# EAGLE design SOCL 506 GINDRING (EAGLE 9.6.2)
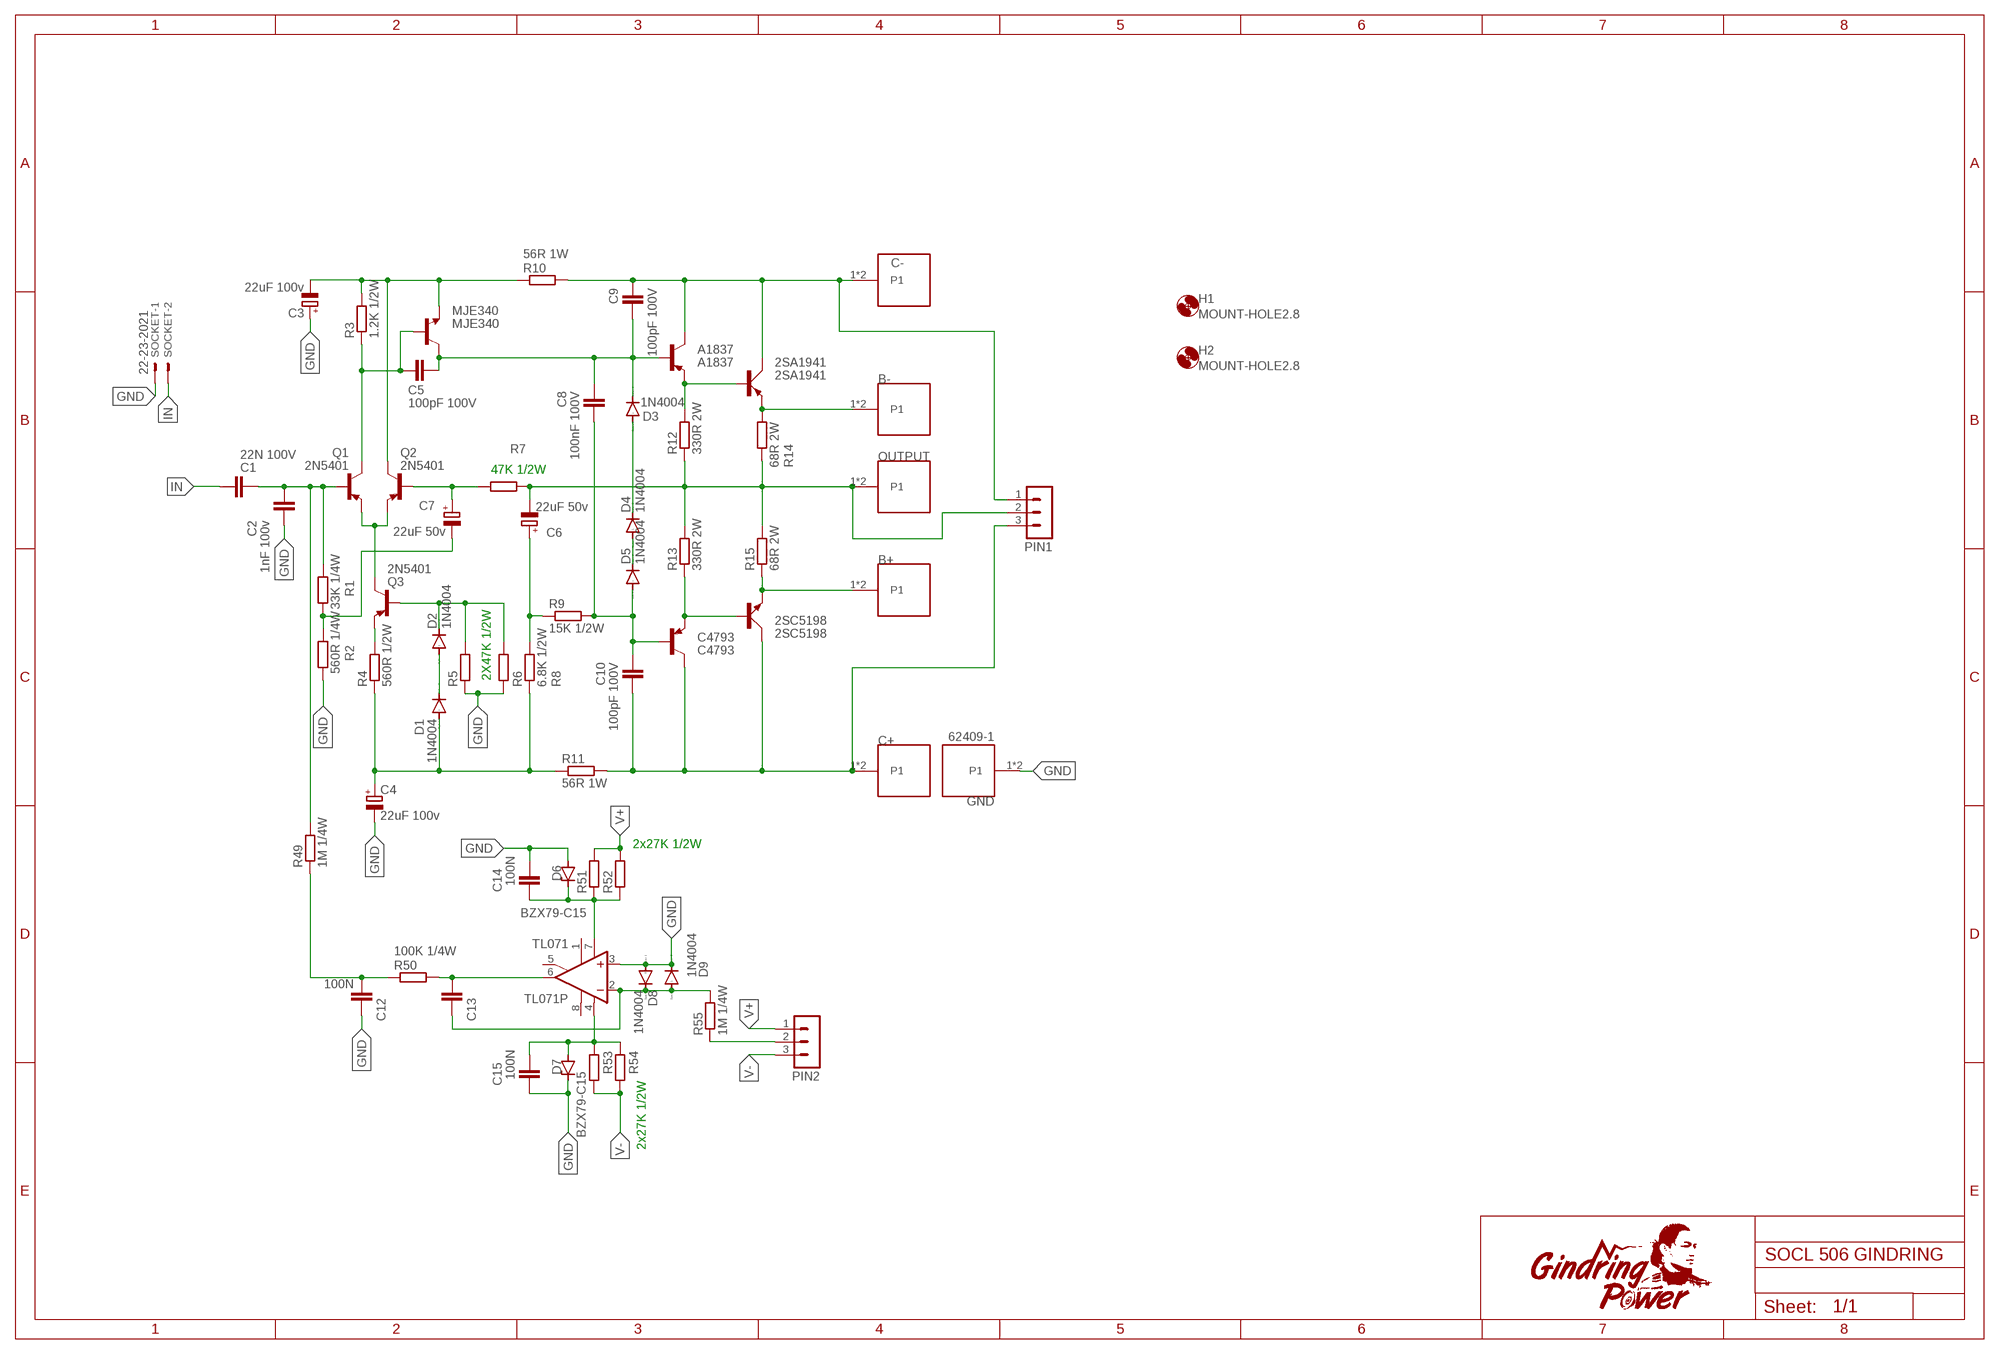
[diagram p0: schematic, sheet 1]

## Parts
2SA1941  2SA1941  TIP2955  [TOP3AV]
2SC5198  2SC5198  TIP3055  [TOP3AV]
A1837  A1837  2SA1837  [TO220V]
B+  62409-1  [TE_62409-1]
B-  62409-1  [TE_62409-1]
C1  22N 100V  C5/2.5  [C5B2.5]
C2  1nF 100v  C5/2.5  [C5B2.5]
C3  22uF 100v  CPOL-EUE3.5-8  [E3,5-8]
C4  22uF 100v  CPOL-EUE3.5-8  [E3,5-8]
C5  100pF 100V  C5/2.5  [C5B2.5]
C6  22uF 50v  CPOL-EUE2,5-6E  [E2,5-6E]
C7  22uF 50v  CPOL-EUE2,5-6E  [E2,5-6E]
C8  100nF 100V  C5/2.5  [C5B2.5]
C9  100pF 100V  C5/2.5  [C5B2.5]
C10  100pF 100V  C5/2.5  [C5B2.5]
C12  100N  C5/2.5  [C5B2.5]
C13  100N  C5/2.5  [C5B2.5]
C14  100N  C5/2.5  [C5B2.5]
C15  100N  C5/2.5  [C5B2.5]
C4793  C4793  2SA1837  [TO220V]
C+  62409-1  [TE_62409-1]
C-  62409-1  [TE_62409-1]
D1  1N4004  [DO41-10]
D2  1N4004  [DO41-10]
D3  1N4004  [DO41-10]
D4  1N4004  [DO41-10]
D5  1N4004  [DO41-10]
D6  BZX79-C15  1N4728  [DO41Z10]
D7  BZX79-C15  1N4728  [DO41Z10]
D8  1N4004  [DO41-10]
D9  1N4004  [DO41-10]
GND  62409-1  [TE_62409-1]
H1  MOUNT-HOLE2.8  [2,8]
H2  MOUNT-HOLE2.8  [2,8]
MJE340  MJE340  [TO126]
OUTPUT  62409-1  [TE_62409-1]
PIN1  MA03-1  [MA03-1]
PIN2  MA03-1  [MA03-1]
Q1  2N5401  MPSA56-TO92  [TO92-CBE]
Q2  2N5401  MPSA56-TO92  [TO92-CBE]
Q3  2N5401  MPSA56-TO92  [TO92-CBE]
R1  33K 1/4W  R-EU_0207/10  [0207/10]
R2  560R 1/4W  R-EU_0207/10  [0207/10]
R3  1.2K 1/2W  R-EU_0207/15  [0207/15]
R4  560R 1/2W  R-EU_0207/15  [0207/15]
R5  R-EU_0207/15  [0207/15]
R6  R-EU_0207/15  [0207/15]
R7  R-EU_0207/15  [0207/15]
R8  6.8K 1/2W  R-EU_0207/15  [0207/15]
R9  15K 1/2W  R-EU_0207/15  [0207/15]
R10  56R 1W  R-EU_0207/15  [0207/15]
R11  56R 1W  R-EU_0207/15  [0207/15]
R12  330R 2W  R-EU_0207/15  [0207/15]
R13  330R 2W  R-EU_0207/15  [0207/15]
R14  68R 2W  R-EU_0207/15  [0207/15]
R15  68R 2W  R-EU_0207/15  [0207/15]
R49  1M 1/4W  R-EU_0207/10  [0207/10]
R50  100K 1/4W  R-EU_0207/10  [0207/10]
R51  R-EU_0207/15  [0207/15]
R52  R-EU_0207/15  [0207/15]
R53  R-EU_0207/15  [0207/15]
R54  R-EU_0207/15  [0207/15]
R55  1M 1/4W  R-EU_0207/10  [0207/10]
SOCKET  22-23-2021  [22-23-2021]
TL071  TL071P  [DIL08]

## Nets
GND: C2.2 C3.+ C4.- C12.1 C14.2 C15.1 D6.A D7.C D8.A D9.C GND.1 GND.2(P1) R2.1 R5.1 R6.1 SOCKET.1 TL071.3(+IN)
IN: C1.1 SOCKET.2
N$1: C1.2 C2.1 Q1.B R1.2 R49.2
N$2: Q1.E Q2.E Q3.C
N$3: C5.1 MJE340.3(B) Q1.C R3.1
N$4: C7.- R1.1 R2.2
N$5: C3.- MJE340.1(E) Q2.C R3.2 R10.1
N$6: Q3.E R4.2
N$7: D2.C Q3.B R5.2 R6.2
N$8: D1.C D2.A
N$9: C4.+ D1.A R4.1 R8.1 R11.1
N$10: C7.+ Q2.B R7.1
N$11: 2SC5198.B C4793.3(E) R13.1
N$12: C6.- OUTPUT.1 OUTPUT.2(P1) PIN1.2 R7.2 R12.1 R13.2 R14.1 R15.2
N$13: C6.+ R8.2 R9.1
N$14: C8.1 C10.2 C4793.1(B) D5.A R9.2
N$15: 2SA1941.C A1837.2(C) C9.2 C-.1 C-.2(P1) PIN1.1 R10.2
N$16: A1837.1(B) C5.2 C8.2 C9.1 D3.C MJE340.2(C)
N$17: D3.A D4.C
N$18: D4.A D5.C
N$19: 2SC5198.C C10.1 C4793.2(C) C+.1 C+.2(P1) PIN1.3 R11.2
N$20: 2SA1941.B A1837.3(E) R12.2
N$21: 2SA1941.E B-.1 B-.2(P1) R14.2
N$22: C12.2 R49.1 R50.1
N$23: 2SC5198.E B+.1 B+.2(P1) R15.1
N$25: C14.1 D6.C R51.1 R52.1 TL071.7(V+)
N$26: C13.1 D8.C D9.A R55.2 TL071.2(-IN)
N$27: C15.2 D7.A R53.2 R54.2 TL071.4(V-)
N$28: C13.2 R50.2 TL071.6(OUT)
N$30: PIN2.2 R55.1
V+: PIN2.1 R51.2 R52.2
V-: PIN2.3 R53.1 R54.1
Unconnected: TL071.1(ON1) TL071.5(ON2) TL071.8(OPT)

## Notes on the sheet
- 47K 1/2W
- 2X47K 1/2W
- 2x27K 1/2W
- 2x27K 1/2W

## Library data of the parts
2SA1941 = transistor-power:TIP2955: PNP TRANSISTOR
2SC5198 = transistor-power:TIP3055: NPN TRANSISTOR
A1837 C4793 = 2SA1837:2SA1837: Check availability <https://pricing.snapeda.com/parts/2SA1837/Toshiba%20Semiconductor/view-part?ref=eda>; AVAILABILITY: In Stock; DESCRIPTION: Bipolar (BJT) Transistor PNP 230 V 1 A 70MHz 2 W Through Hole TO-220NIS; MF: Toshiba Semiconductor; MP: 2SA1837; PACKAGE: TO-220 Toshiba Semiconductor; PRICE: None
B+ B- C+ C- GND OUTPUT = 62409-1:62409-1: CONN QC TAB 0.250 SOLDER Check availability <https://pricing.snapeda.com/parts/62409-1/TE%20Connectivity/view-part?ref=eda>; AVAILABILITY: In Stock; COMMENT: 62409-1; DESCRIPTION: Faston 20-16 AWG Straight Non-Insulated Printed Circuit Board Tab Terminal; MF: TE Connectivity; MP: 62409-1; PACKAGE: None; PRICE: None; PURCHASE-URL: https://pricing.snapeda.com/search?q=62409-1&ref=eda
C1 C2 C5 C8-C10 C12-C15 = capacitor-wima:C: CAPACITOR naming: grid - package width
C3 C4 C6 C7 = rcl:CPOL-EU: POLARIZED CAPACITOR, European symbol; SPICEPREFIX: C
D1-D5 D8 D9 = diode:1N4004: DIODE general purpose rectifier, 1 A
D6 D7 = diode:1N4728: Z DIODE 3.3 V, 1W, 5 percent
H1 H2 = holes:MOUNT-HOLE: MOUNTING HOLE with drill center marker
MJE340 = MJE340:MJE340: NPN TRANSISTOR Check availability <https://pricing.snapeda.com/parts/MJE340/STMicroelectronics/view-part?ref=eda>; AVAILABILITY: In Stock; DESCRIPTION: Bipolar (BJT) Transistor NPN 300 V 500 mA - 20.8 W Through Hole SOT-32-3; MF: STMicroelectronics; MP: MJE340; PACKAGE: TO-126-3 Motorola; PRICE: None; PURCHASE-URL: https://pricing.snapeda.com/search?q=MJE340&ref=eda
PIN1 PIN2 = con-lstb:MA03-1: PIN HEADER; OC_FARNELL: unknown; OC_NEWARK: unknown
Q1-Q3 = transistor-pnp:*-?: PNP Transistor
R1 R2 R49 R50 R55 = resistor 2:R-EU_: RESISTOR, European symbol; SPICEPREFIX: R
R3-R15 R51-R54 = resistor coba:R-EU_: RESISTOR, European symbol; SPICEPREFIX: R
SOCKET = con-molex:22-23-2021: .100" (2.54mm) Center Header - 2 Pin; MF: MOLEX; MPN: 22-23-2021; OC_FARNELL: 1462926; OC_NEWARK: 25C3832
TL071 = TL071:TL071: OP AMP Check availability <https://pricing.snapeda.com/parts/TL071/STMicroelectronics/view-part?ref=eda>; AVAILABILITY: Not in stock; CHECK_PRICES: https://www.snapeda.com/parts/TL071/STMicroelectronics/view-part/?ref=eda; DESCRIPTION: Op Amp Single Low Noise Amplifier ±18V 8-Pin SO N T/R; MF: STMicroelectronics; MP: TL071; PACKAGE: None; PRICE: None; SNAPEDA_LINK: https://www.snapeda.com/parts/TL071/STMicroelectronics/view-part/?ref=snap

## Board
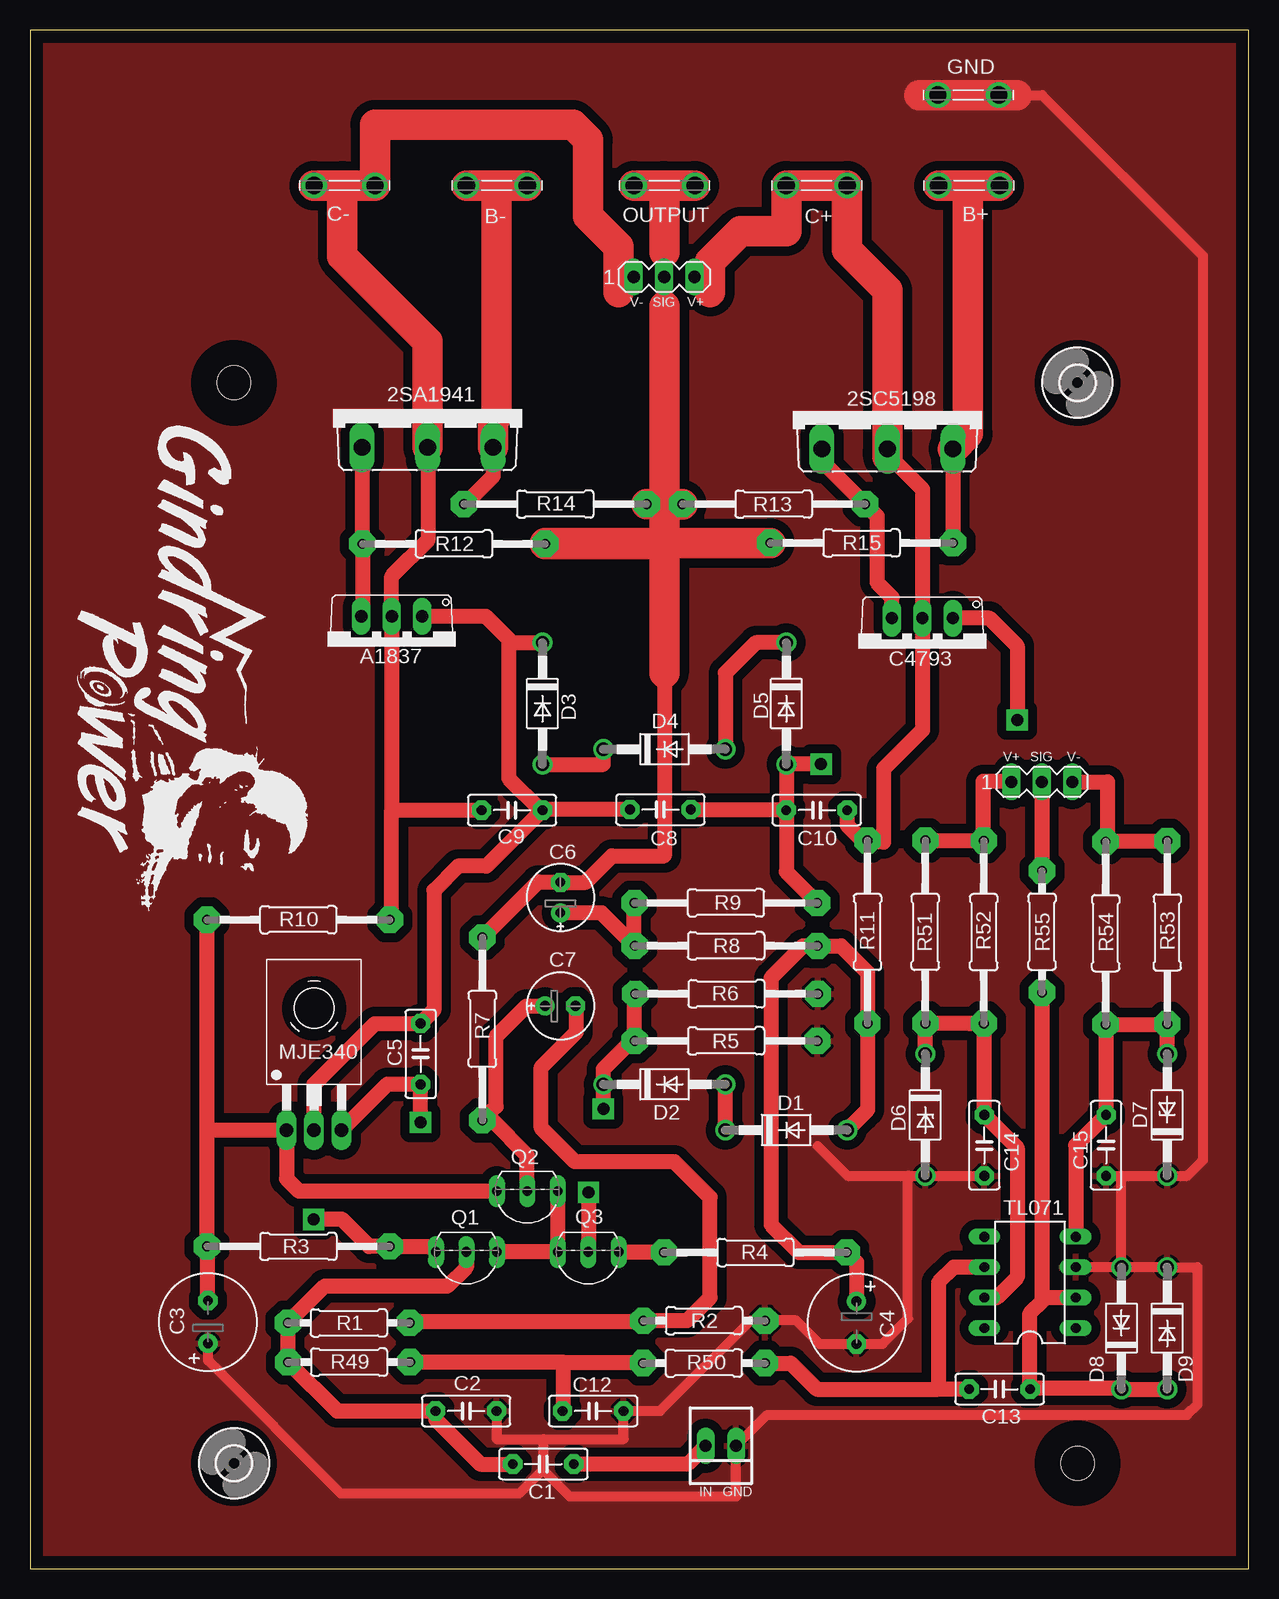
[diagram p1: board, top side]
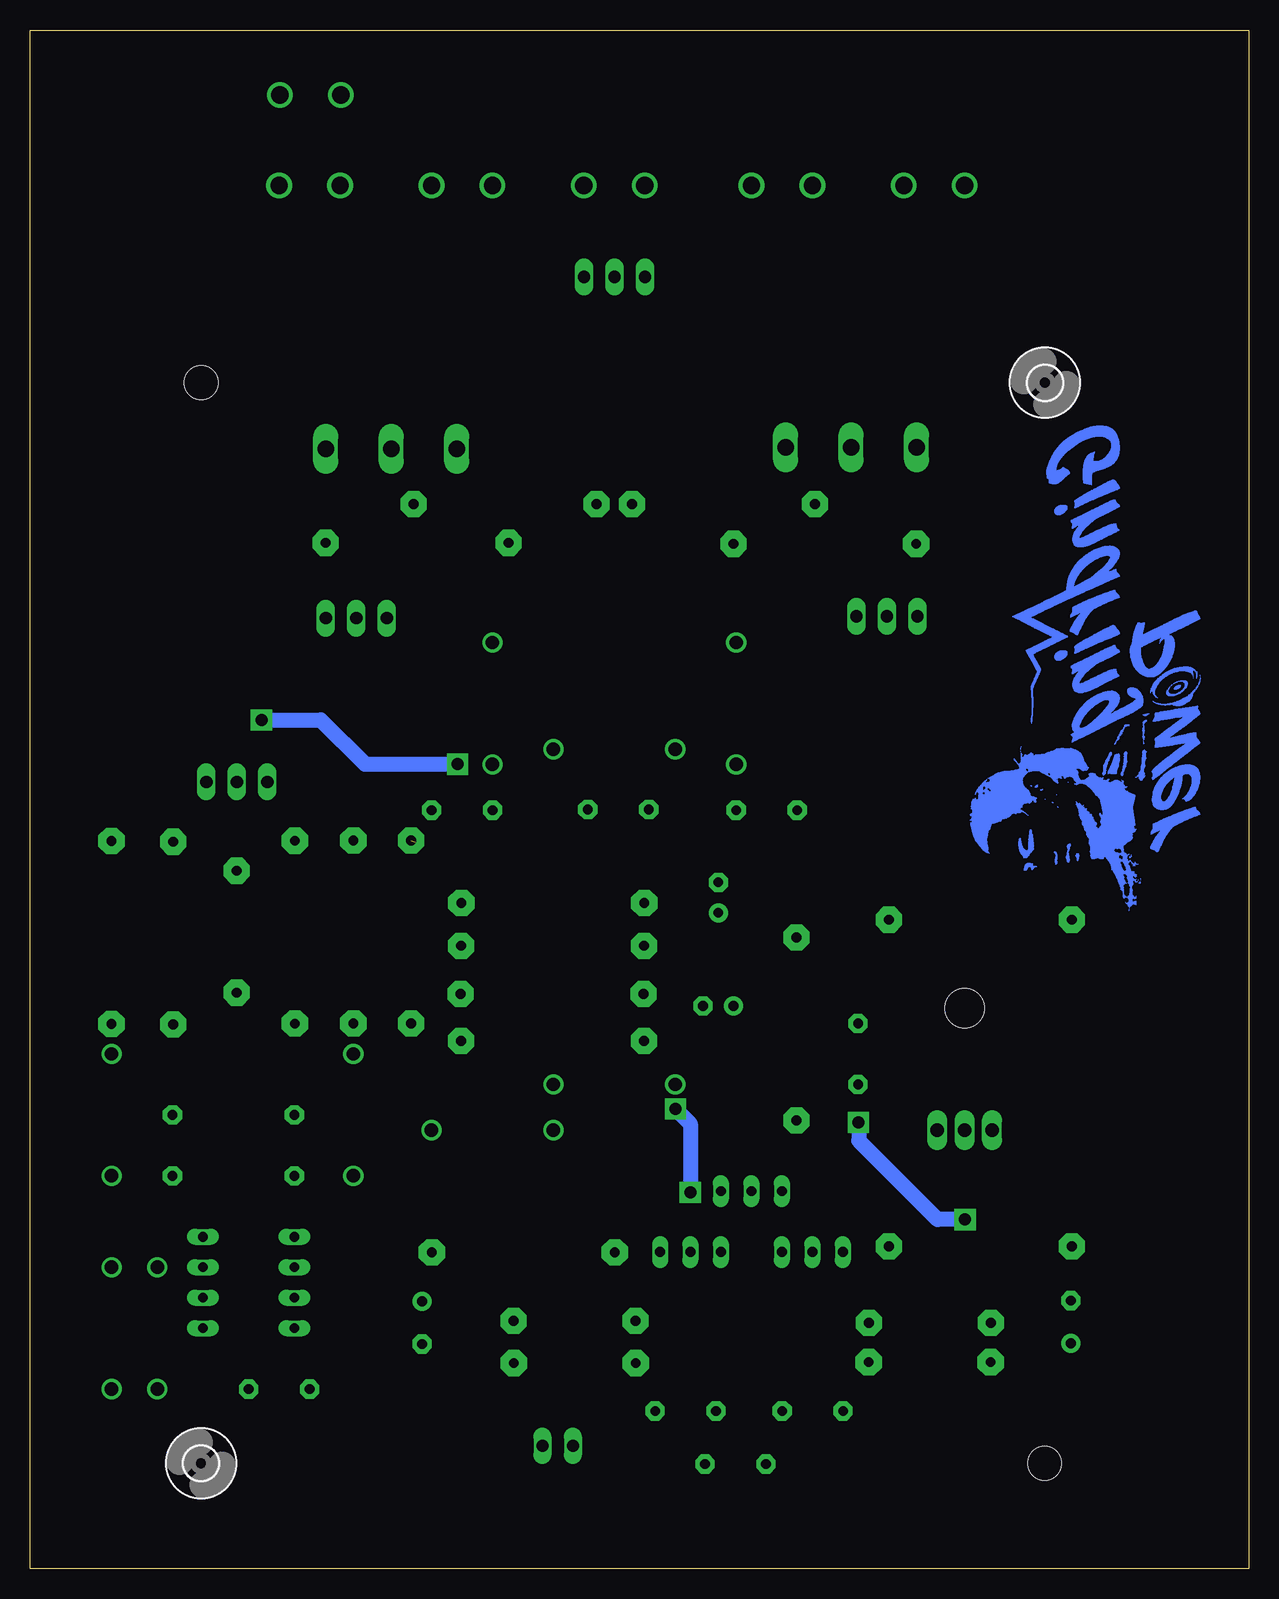
[diagram p2: board, bottom side, seen from below]

Size 101.6 x 128.27 mm. Coordinates in mm from the lower left corner, seen from the top.
Outline: 0,128.27 0,0 101.6,0 101.6,128.27 0,128.27
Copper layers (1*16): Top 0.035mm / dielectric 1.5mm / Bottom 0.035mm
Design rules "default *": minimum track width 6mil, minimum drill 0.35mm, track to track 30mil, track to pad 30mil, pad to pad 30mil, via to via 30mil, smd to smd 30mil, copper to edge 40mil, drill to drill 6mil, minimum pad ring 10mil, minimum via ring 8mil, stop-mask expansion 4mil, vias tented up to drill 0mil, thermal gap 10mil

### Footprints (pad centres in the part's own frame; a part is rotated, then mirrored left to right if it is on the bottom)
TOP3AV = drill 1.397 long: B -5.461,-3.175; C 0,-3.175; E 5.461,-3.175
TO220V = drill 1.016 long: 1 -2.54,-2.54; 2 0,-2.54; 3 2.54,-2.54
TE_62409-1 = drill 1.43: 1 -2.54,0; 2 2.54,0
C5B2.5 = drill 0.813 pad 1.6 octagon: 1 -2.54,0; 2 2.54,0
E3,5-8 = drill 0.813 pad 1.6: + -1.778,0 | drill 0.813 pad 1.6 octagon: - 1.778,0
E2,5-6E = drill 0.813 pad 1.575: + -1.27,0 | drill 0.813 pad 1.575 octagon: - 1.27,0
DO41-10 = drill 1.118: A 5.08,0; C -5.08,0
DO41Z10 = drill 1.118: A 5.08,0; C -5.08,0
2,8 = hole 2.8: 0,0
TO126 = drill 1.118 long: 1 -2.286,-5.08; 2 0,-5.08; 3 2.286,-5.08 | hole 3.302: 0,5.08
MA03-1 = drill 1.016 long: 1 -2.54,0; 2 0,0; 3 2.54,0
TO92-CBE = drill 0.813 long: B 0,0; C 2.54,0; E -2.54,0
0207/10 = drill 0.813 pad 2.184 octagon: 1 -5.08,0; 2 5.08,0
0207/15 = drill 0.813 pad 2.184 octagon: 1 -7.62,0; 2 7.62,0
22-23-2021 = drill 1 long: 1 -1.27,0; 2 1.27,0
DIL08 = drill 0.813 pad 1.27 long: 1 -3.81,-3.81; 2 -1.27,-3.81; 3 1.27,-3.81; 4 3.81,-3.81; 5 3.81,3.81; 6 1.27,3.81; 7 -1.27,3.81; 8 -3.81,3.81

### Placement (x,y rotation side)
2SA1941  33.15,96.66 0 top
2SC5198  71.48,96.52 0 top
A1837  30.16,76.86 180 top
B+  78.29,115.31 0 top
B-  38.92,115.31 180 top
C1  42.79,8.73 180 top
C2  36.36,13.15 0 top
C3  14.83,20.57 90 top
C4  68.91,20.51 270 top
C5  32.57,42.92 90 top
C6  44.22,55.95 90 top
C7  44.22,46.91 0 top
C8  52.55,63.28 180 top
C9  40.19,63.24 180 top
C10  65.59,63.24 180 top
C12  46.94,13.15 180 top
C13  80.83,14.98 180 top
C14  79.56,35.3 270 top
C15  89.72,35.3 90 top
C4793  74.4,76.7 180 top
C+  65.59,115.31 180 top
C-  26.22,115.31 180 top
D1  63.05,36.57 0 top
D2  52.89,40.38 0 top
D3  42.73,72.13 270 top
D4  52.89,68.32 0 top
D5  63.05,72.13 270 top
D6  74.64,37.84 270 top
D7  94.8,37.84 90 top
D8  90.99,20.06 90 top
D9  94.8,20.06 270 top
GND  78.22,122.85 0 top
H1  17.01,8.79 90 top
H2  87.34,8.79 90 bottom
H5  MOUNT-HOLE2.8  [2,8]  16.99,98.87 270 bottom
H6  MOUNT-HOLE2.8  [2,8]  87.32,98.87 270 top
MJE340  23.68,41.65 0 top
OUTPUT  52.89,115.31 0 top
PIN1  52.87,107.69 0 top
PIN2  84.35,65.59 0 top
Q1  36.38,26.41 180 top
Q2  41.46,31.49 180 top
Q3  46.54,26.41 180 top
R1  26.58,20.49 180 top
R2  56.21,20.68 180 top
R3  22.37,26.87 180 top
R4  60.47,26.37 180 top
R5  58.03,44 180 top
R6  58.07,47.92 180 top
R7  37.71,45 90 top
R8  58.03,51.93 180 top
R9  58.01,55.5 0 top
R10  22.37,54.1 0 top
R11  69.82,53.09 90 top
R12  35.34,85.44 180 top
R13  62,88.75 180 top
R14  43.79,88.75 180 top
R15  69.33,85.52 180 top
R49  26.6,17.22 180 top
R50  56.18,17.14 0 top
R51  74.64,53.09 90 top
R52  79.51,53.07 90 top
R53  94.81,53.05 270 top
R54  89.67,52.98 270 top
R55  84.37,53.11 270 top
SOCKET  57.6,10.25 180 top
TL071  83.37,23.87 90 top

### Tracks (layer width: path | path; a pad name or v marks a point on that pad's centre or on a via)
GND
  Top 0.813: C2.2 38.9,10.81 42.83,10.81 | 42.83,10.81 49.48,10.81 C12.1 52.54,13.15 60.07,20.68 R2.1 61.31,20.7 63.86,20.7 65.82,18.73 C4.- 71.08,18.73 73.21,20.86 73.21,32.76 | 73.21,32.76 D6.A | 74.7,32.76 C14.2 | 94.83,25.14 97.34,25.14 97.34,13.71 96.45,12.82 61.44,12.82 SOCKET.1 58.87,6.04 44.99,6.04 42.77,8.26 | D9.C D8.A 90.99,32.76 | 90.97,25.14 TL071.3 | C15.1 90.99,32.76 | 90.99,32.76 D7.C | 42.77,8.26 40.77,6.26 25.93,6.26 14.83,17.36 C3.+ | 42.77,8.26 42.83,8.32 42.83,10.81 | 73.21,32.76 68.13,32.76 65.65,35.23 | 82.29,122.85 84.37,122.85 97.8,109.42 97.8,34.08 96.48,32.76 94.87,32.76
  Top 1.27: D6.A 74.7,32.76 | D7.C 94.87,32.76 | D9.C 94.83,25.14 | D8.A 90.97,25.14
  Top 2.54: 82.29,122.85 GND.2 GND.1 74.16,122.85
  pour Top: 0,128.27 0,0 101.6,0 101.6,128.27
IN
  Top 1.27: SOCKET.2 54.81,8.73 C1.1
N$1
  Top 1.27: Q1.B 36.38,25.14 34.81,23.57 24.57,23.57 R1.2 21.5,17.24 R49.2 25.59,13.15 C2.1 33.82,12.46 37.55,8.73 C1.2
N$2
  Top 1.27: Q2.E Q3.C Q1.E
N$3  (via drill 1 pad 1.78)
  Top 1.27: MJE340.3 29.77,40.38 C5.1 32.54,40.35 v32.54,37.21 | v23.65,29.11 23.67,29.13 26.01,29.13 28.27,26.87 R3.1 33.37,26.87 Q1.C
  Bottom 0.61: v23.65,29.11 23.62,29.13
  Bottom 1.27: v32.54,37.21 32.52,37.21 32.5,37.23 32.5,35.67 25.94,29.11 v23.65,29.11
N$4
  Top 1.27: 31.86,20.7 R1.1 31.76,20.59 51,20.59 51.08,20.68 R2.2 54.78,20.68 56.7,22.6 56.7,30.97 53.74,33.92 45.44,33.92 42.61,36.75 42.61,41.8 45.52,44.71 45.52,46.87 C7.-
N$5
  Top 1.27: Q2.C 22.41,31.49 21.39,32.5 MJE340.1 14.79,36.57 | 14.79,36.57 14.79,54.07 R10.1 | 14.79,36.57 14.79,26.91 R3.2 14.75,22.43 C3.-
N$6
  Top 1.27: R4.2 49.12,26.36 Q3.E
N$7  (via drill 1 pad 1.78)
  Top 1.27: v46.56,31.38 46.56,26.43 Q3.B | v47.79,38.33 47.79,40.36 D2.C 47.81,41.65 50.16,44 R5.2 50.41,47.88 R6.2
  Bottom 1.27: v46.56,31.38 46.56,37.1 v47.79,38.33
N$8
  Top 1.27: D1.C D2.A
N$9
  Top 1.27: 69.4,37.84 D1.A 69.82,38.26 R11.1 69.82,49.71 67.61,51.93 R8.1 64.44,51.93 61.78,49.27 61.78,28.68 64.09,26.36 R4.1 | R4.1 68.13,26.33 | R4.1 68.91,25.55 C4.+
N$10
  Top 1.27: R7.1 37.76,37.42 | Q2.B 41.46,34.47 38.55,37.38 R7.1 | R7.1 38.87,38.54 38.87,44.39 41.39,46.91 C7.+
N$11
  Top 1.27: C4793.3 71.86,80.97 70.61,82.22 70.61,87.76 R13.1 66.02,92.34 2SC5198.B 66.02,91.92
N$12
  Top 1.27: 52.89,74.67 52.89,59.43 48.52,59.43 46.31,57.22 C6.- 44.18,57.26 42.36,57.26 R7.2 | 52.89,109.76 52.89,109.75 52.87,109.73 PIN1.2 52.87,105.27 52.89,105.25
  Top 2.54: 52.85,115.31 OUTPUT.2 | 52.89,85.44 52.89,74.67 | 52.89,109.75 52.89,115.27 52.85,115.31 | OUTPUT.1 52.85,115.31 | 52.89,105.25 52.89,88.72 | R12.1 52.89,85.44 | R12.1 52.58,85.44 52.89,85.74 | 52.89,85.74 52.89,88.72 | 52.89,85.44 52.89,85.74 | 52.89,88.72 52.86,88.75 R14.1 R13.2 54.38,88.72 52.89,88.72 | R12.1 42.96,85.52 R15.2
N$13
  Top 1.27: R9.1 50.35,55.46 50.35,51.99 R8.2 47.66,54.68 C6.+
N$14  (via drill 1 pad 1.78)
  Top 1.27: C10.2 D5.A 63.07,67.07 v65.95,67.07 | v82.3,70.75 82.3,76.92 79.98,79.24 C4793.1 | R9.2 63.05,58.09 C10.2 | C10.2 55.14,63.24 C8.1
  Bottom 1.27: v82.3,70.75 77.37,70.75 73.68,67.07 v65.95,67.07
N$15
  Top 1.27: PIN1.1 49.08,107.69 | 2SA1941.C 33.17,93.47 33.17,85.74 30.16,82.73 A1837.2 30.16,63.24 | 30.16,63.24 C9.2 | 30.16,63.24 30.16,54.63 29.99,54.46 R10.2
  Top 2.54: 49.08,106.42 49.08,107.69 49.08,110.23 46.54,112.77 46.54,119.12 45.27,120.39 28.76,120.39 C-.1 26.03,115.31 | 23.66,115.29 C-.2 26.03,115.31 | 2SA1941.C 33.15,102.31 26.03,109.42 26.03,115.31
N$16
  Top 1.27: 39.9,77.49 37.99,79.4 A1837.1 | 39.9,77.49 40.19,77.21 D3.C | MJE340.2 23.68,40.38 28.76,45.46 C5.2 33.69,46.57 33.69,56.56 35.69,58.56 38.05,58.56 C9.1 42.54,63.24 | 39.9,77.49 39.9,65.88 42.54,63.24 | C8.2 42.59,63.28 42.54,63.24
N$17
  Top 1.27: D3.A 47.81,67.05 D4.C
N$18
  Top 1.27: D5.C 60.51,77.21 57.97,74.67 D4.A
N$19  (1 unrouted)
  Top 1.27: PIN1.3 56.7,107.69 | C10.1 68.13,61.97 69.39,60.71 R11.2 | 2SC5198.C 71.48,92.9 74.4,89.99 C4793.2 74.4,69.91 71.16,66.68 71.16,60.58 69.51,60.58
  Top 2.54: 56.7,106.42 56.7,107.69 56.7,108.96 59.24,111.5 63.05,111.5 C+.2 C+.1 68.11,115.29 68.11,109.95 71.48,106.57 2SC5198.C 71.48,92.71
N$20
  Top 1.27: 2SA1941.B 27.69,85.47 R12.2 27.72,79.5 A1837.3
N$21
  Top 1.27: 2SA1941.E 38.61,91.1 36.26,88.75 R14.2
  Top 2.54: B-.1 B-.2 38.9,115.31 38.9,96.04 38.61,95.75 2SA1941.E
N$22
  Top 1.27: 44.43,17.22 51.19,17.22 R50.1 | 44.43,17.22 | 44.43,17.22 44.43,13.17 C12.2 | 44.43,17.22 R49.1
N$23
  Top 1.27: 2SC5198.E R15.1 | R15.1 | R15.1
  Top 2.54: 2SC5198.E 78.2,94.61 78.2,115.23 78.27,115.31 | B+.2 78.27,115.31 | 78.27,115.31 B+.1
N$25
  Top 1.27: TL071.7 80.59,22.6 82.3,24.31 82.3,35.09 C14.1 79.51,37.88 R52.1 | 79.53,45.47 78.29,45.47 | 78.29,45.47 R51.1 D6.C | R52.1 79.53,45.47 | 79.53,45.47 79.55,45.47 | R52.1 78.31,45.45 78.29,45.47
N$26
  Top 1.27: D9.A D8.C 90.94,15.03 83.42,15.03 C13.1 83.37,21.33 84.38,22.34 | 84.38,22.34 84.38,48.01 | 84.38,48.01 84.38,48.03 | TL071.2 84.64,22.6 84.38,22.34 | R55.2 84.38,48.01
N$27
  Top 1.27: TL071.4 87.18,35.3 C15.2 89.67,37.88 R54.2 94.69,45.36 94.78,45.46 R53.2 94.81,42.93 D7.A
N$28
  Top 1.27: C13.2 75.75,14.98 | 75.75,14.98 65.59,14.98 63.42,17.14 R50.2 | TL071.6 77.02,25.14 75.75,23.87 75.75,14.98
N$30
  Top 1.27: PIN2.2 | PIN2.2 84.35,58.2 R55.1
V+
  Top 1.27: PIN2.1 81.77,65.63 79.46,65.63 79.46,60.74 | 79.46,60.74 R52.2 | R51.2 79.42,60.71 79.46,60.74
V-
  Top 1.27: PIN2.3 89.82,65.59 89.82,60.75 R54.1 89.73,60.66 R53.1
(copper drawn outside any net)
  shapes: Bottom area x8723

### Text on the board
tNames: V- | SIG | V+ | 2SC5198 | V+ | SIG | V- | IN | GND